# EAGLE schematic gameboyzero-tft (EAGLE 8.3.2)
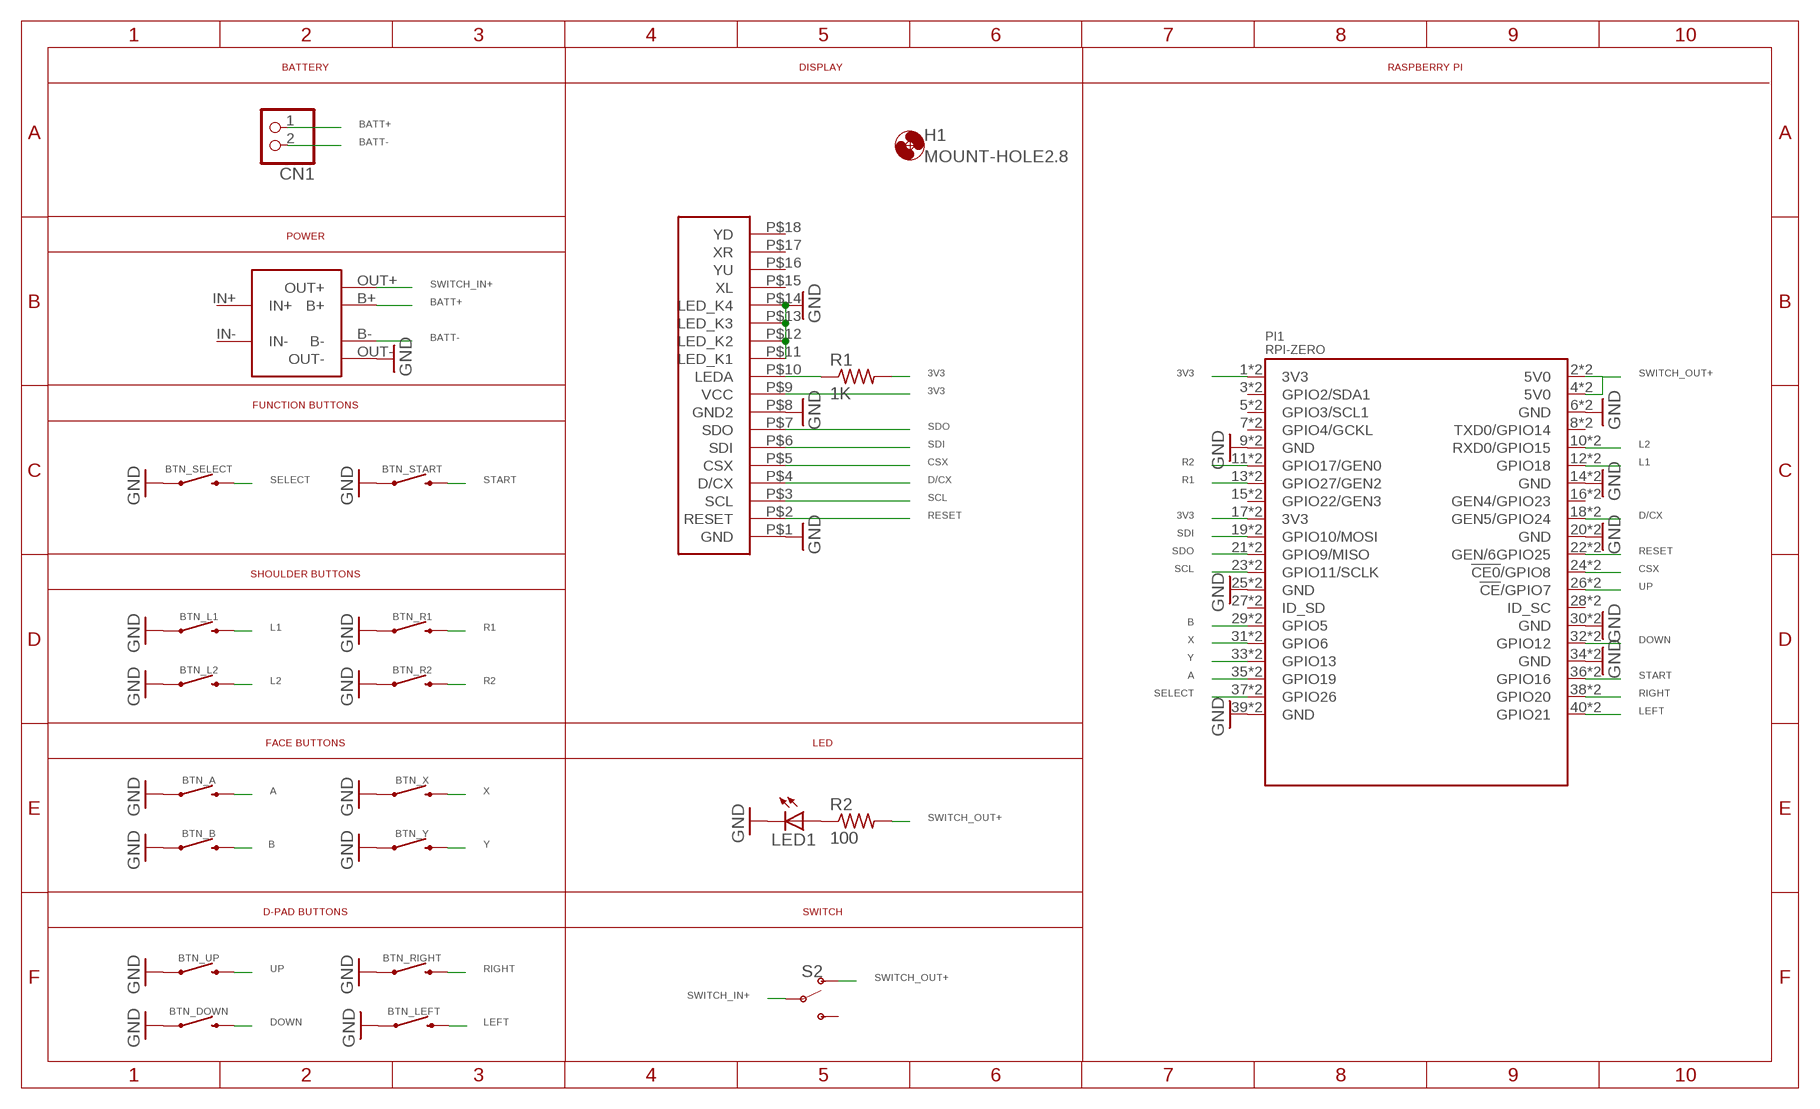
[diagram p0: schematic, sheet 1]

## Parts
BTN_A  MOMENTARY-SWITCH-SPST-SMD-12MM  [TACTILE_SWITCH_SMD_12MM]
BTN_B  MOMENTARY-SWITCH-SPST-SMD-12MM  [TACTILE_SWITCH_SMD_12MM]
BTN_DOWN  MOMENTARY-SWITCH-SPST-SMD-6.2MM-TALL  [TACTILE_SWITCH_SMD_6.2MM_TALL]
BTN_L1  MOMENTARY-SWITCH-SPST-SMD-12MM  [TACTILE_SWITCH_SMD_12MM]
BTN_L2  MOMENTARY-SWITCH-SPST-SMD-12MM  [TACTILE_SWITCH_SMD_12MM]
BTN_LEFT  MOMENTARY-SWITCH-SPST-SMD-6.2MM-TALL  [TACTILE_SWITCH_SMD_6.2MM_TALL]
BTN_R1  MOMENTARY-SWITCH-SPST-SMD-12MM  [TACTILE_SWITCH_SMD_12MM]
BTN_R2  MOMENTARY-SWITCH-SPST-SMD-12MM  [TACTILE_SWITCH_SMD_12MM]
BTN_RIGHT  MOMENTARY-SWITCH-SPST-SMD-6.2MM-TALL  [TACTILE_SWITCH_SMD_6.2MM_TALL]
BTN_SELECT  MOMENTARY-SWITCH-SPST-SMD-6.0X3.5MM  [TACTILE_SWITCH_SMD_6.0X3.5MM]
BTN_START  MOMENTARY-SWITCH-SPST-SMD-6.0X3.5MM  [TACTILE_SWITCH_SMD_6.0X3.5MM]
BTN_UP  MOMENTARY-SWITCH-SPST-SMD-6.2MM-TALL  [TACTILE_SWITCH_SMD_6.2MM_TALL]
BTN_X  MOMENTARY-SWITCH-SPST-SMD-12MM  [TACTILE_SWITCH_SMD_12MM]
BTN_Y  MOMENTARY-SWITCH-SPST-SMD-12MM  [TACTILE_SWITCH_SMD_12MM]
CN1  JST_2PIN-SMT  [JST-PH-2-SMT]
H1  MOUNT-HOLE2.8  [2,8]
LED1  LEDCHIPLED_0805  [CHIPLED_0805]
PI1  RPI-ZERO  [RASPBERRYPI_BASTELSTUBE_V13_RASPI_BOARD_B+_FULL]
POWER1  03962A  [03962A]
R1  1K  R-US_R0805  [R0805]
R2  100  R-US_R0805  [R0805]
S2  SWITCH-SPDT-SMD-RIGHT-ANGLE  [SWITCH_SPST_SMD_A]
SCREEN1  GAMEBOYZEROHANDHELDDISPLAYS-2.8  [GAMEBOYZEROHANDHELDDISPLAYS-2.8]

## Nets
3V3: PI1.1(3V3) PI1.17(3V3) PI1.41(3V3) PI1.57(3V3) R1.2 SCREEN1.P$9(VCC)
3V3100OHM: R1.1 SCREEN1.P$10(LEDA)
A: BTN_A.3 PI1.35(GPIO19) PI1.75(GPIO19)
B: BTN_B.3 PI1.29(GPIO5) PI1.69(GPIO5)
BATT+: CN1.1 POWER1.B+
BATT-: CN1.2 POWER1.B-
CSX: PI1.24(!CE0!/GPIO8) PI1.64(!CE0!/GPIO8) SCREEN1.P$5(CSX)
D/CX: PI1.18(GEN5/GPIO24) PI1.58(GEN5/GPIO24) SCREEN1.P$4(D/CX)
DOWN: BTN_DOWN.B2 PI1.32(GPIO12) PI1.72(GPIO12)
GND: BTN_A.1 BTN_B.1 BTN_DOWN.A2 BTN_L1.1 BTN_L2.1 BTN_LEFT.A2 BTN_R1.1 BTN_R2.1 BTN_RIGHT.A2 BTN_SELECT.1 BTN_START.1 BTN_UP.A2 BTN_X.1 BTN_Y.1 LED1.C PI1.6(GND) PI1.9(GND) PI1.14(GND) PI1.20(GND) PI1.25(GND) PI1.30(GND) PI1.34(GND) PI1.39(GND) PI1.46(GND) PI1.49(GND) PI1.54(GND) PI1.60(GND) PI1.65(GND) PI1.70(GND) PI1.74(GND) PI1.79(GND) POWER1.OUT- SCREEN1.P$1(GND) SCREEN1.P$8(GND2) SCREEN1.P$11(LED_K1) SCREEN1.P$12(LED_K2) SCREEN1.P$13(LED_K3) SCREEN1.P$14(LED_K4)
L1: BTN_L1.3 PI1.12(GPIO18) PI1.52(GPIO18)
L2: BTN_L2.3 PI1.10(RXD0/GPIO15) PI1.50(RXD0/GPIO15)
LED: LED1.A R2.1
LEFT: BTN_LEFT.B2 PI1.40(GPIO21) PI1.80(GPIO21)
R1: BTN_R1.3 PI1.13(GPIO27/GEN2) PI1.53(GPIO27/GEN2)
R2: BTN_R2.3 PI1.11(GPIO17/GEN0) PI1.51(GPIO17/GEN0)
RESET: PI1.22(GEN/6GPIO25) PI1.62(GEN/6GPIO25) SCREEN1.P$2(RESET)
RIGHT: BTN_RIGHT.B2 PI1.38(GPIO20) PI1.78(GPIO20)
SCL: PI1.23(GPIO11/SCLK) PI1.63(GPIO11/SCLK) SCREEN1.P$3(SCL)
SDI: PI1.19(GPIO10/MOSI) PI1.59(GPIO10/MOSI) SCREEN1.P$6(SDI)
SDO: PI1.21(GPIO9/MISO) PI1.61(GPIO9/MISO) SCREEN1.P$7(SDO)
SELECT: BTN_SELECT.2 PI1.37(GPIO26) PI1.77(GPIO26)
START: BTN_START.2 PI1.36(GPIO16) PI1.76(GPIO16)
SWITCH_IN+: POWER1.OUT+ S2.2(P)
SWITCH_OUT+: PI1.2(5V0) PI1.4(5V0) PI1.42(5V0) PI1.44(5V0) R2.2 S2.1(O)
UP: BTN_UP.B2 PI1.26(!CE!/GPIO7) PI1.66(!CE!/GPIO7)
X: BTN_X.3 PI1.31(GPIO6) PI1.71(GPIO6)
Y: BTN_Y.3 PI1.33(GPIO13) PI1.73(GPIO13)
Unconnected: PI1.3(GPIO2/SDA1) PI1.5(GPIO3/SCL1) PI1.7(GPIO4/GCKL) PI1.8(TXD0/GPIO14) PI1.15(GPIO22/GEN3) PI1.16(GEN4/GPIO23) PI1.27(ID_SD) PI1.28(ID_SC) PI1.43(GPIO2/SDA1) PI1.45(GPIO3/SCL1) PI1.47(GPIO4/GCKL) PI1.48(TXD0/GPIO14) PI1.55(GPIO22/GEN3) PI1.56(GEN4/GPIO23) PI1.67(ID_SD) PI1.68(ID_SC) POWER1.IN+ POWER1.IN- S2.3(S) SCREEN1.P$15(XL) SCREEN1.P$16(YU) SCREEN1.P$17(XR) SCREEN1.P$18(YD)

## Notes on the sheet
- BATTERY | DISPLAY | RASPBERRY PI
- POWER
- FUNCTION BUTTONS
- SHOULDER BUTTONS
- FACE BUTTONS | LED
- D-PAD BUTTONS | SWITCH

## Library data of the parts
BTN_A BTN_B BTN_L1 BTN_L2 BTN_R1 BTN_R2 BTN_X BTN_Y = SparkFun-Switches:MOMENTARY-SWITCH-SPST: Momentary Switch (Pushbutton) - SPST Normally-open (NO) SPST momentary switches (buttons, pushbuttons). Variants PTH-12MM - 12mm square, through-hole Momentary Pushbutton Switch - 12mm Square <https://www.sparkfun.com/products/9190> (COM-09190) PTH-6.0MM, PTH-6.0MM-KIT - 6.0mm square, through-hole Mini Pushbutton Switch <https://www.sparkfun.com/products/97> (COM-00097) KIT package intended for soldering kit's - only one side of pads' copper is exposed. PTH-RIGHT-ANGLE-KIT - Right-angle, through-hole Right Angle Tactile Button <https://www.sparkfun.com/products/10791> - Used on SparkFun BigTime Watch Kit <https://www.sparkfun.com/products/11734> SMD-12MM - 12mm square, surface-mount Tactile Button - SMD (12mm) <https://www.sparkfun.com/products/12993> (COM-12993) Used on SparkFun PicoBoard <https://www.sparkfun.com/products/11888> SMD-4.5MM - 4.5mm Square Trackball Switch Used on SparkFun Blackberry Trackballer Breakout <https://www.sparkfun.com/products/13169> SMD-4.6MMX2.8MM - 4.60mm x 2.80mm, surface mount Used on SparkFun SAMD21 Mini Breakout <https://www.sparkfun.com/products/13664> SMD-5.2MM, SMD-5.2-REDUNDANT - 5.2mm square, surface-mount Mini Pushbutton Switch - SMD <https://www.sparkfun.com/products/8720> (COM-08720) Used on Arduino Pro Mini <https://www.sparkfun.com/products/11114> REDUNDANT package connects both switch circuits together SMD-6.0X3.5MM - 6.0 x 3.5mm, surface mount Momentary Reset Switch SMD <https://www.sparkfun.com/products/8229> (COM-08229) SMD-6.2MM-TALL - 6.2mm square, surface mount Tactile Button - SMD (6mm) <https://www.sparkfun.com/products/12992> Used on SparkFun Digital Sandbox <https://www.sparkfun.com/products/12651> SMD-RIGHT-ANGLE - Right-angle, surface mount Used on SparkFun Block for Intel® Edison - Arduino <https://www.sparkfun.com/products/13036>; PROD_ID: SWCH-11967; SF_SKU: COM-12993
BTN_DOWN BTN_LEFT BTN_RIGHT BTN_UP = SparkFun-Switches:MOMENTARY-SWITCH-SPST: Momentary Switch (Pushbutton) - SPST Normally-open (NO) SPST momentary switches (buttons, pushbuttons). Variants PTH-12MM - 12mm square, through-hole Momentary Pushbutton Switch - 12mm Square <https://www.sparkfun.com/products/9190> (COM-09190) PTH-6.0MM, PTH-6.0MM-KIT - 6.0mm square, through-hole Mini Pushbutton Switch <https://www.sparkfun.com/products/97> (COM-00097) KIT package intended for soldering kit's - only one side of pads' copper is exposed. PTH-RIGHT-ANGLE-KIT - Right-angle, through-hole Right Angle Tactile Button <https://www.sparkfun.com/products/10791> - Used on SparkFun BigTime Watch Kit <https://www.sparkfun.com/products/11734> SMD-12MM - 12mm square, surface-mount Tactile Button - SMD (12mm) <https://www.sparkfun.com/products/12993> (COM-12993) Used on SparkFun PicoBoard <https://www.sparkfun.com/products/11888> SMD-4.5MM - 4.5mm Square Trackball Switch Used on SparkFun Blackberry Trackballer Breakout <https://www.sparkfun.com/products/13169> SMD-4.6MMX2.8MM - 4.60mm x 2.80mm, surface mount Used on SparkFun SAMD21 Mini Breakout <https://www.sparkfun.com/products/13664> SMD-5.2MM, SMD-5.2-REDUNDANT - 5.2mm square, surface-mount Mini Pushbutton Switch - SMD <https://www.sparkfun.com/products/8720> (COM-08720) Used on Arduino Pro Mini <https://www.sparkfun.com/products/11114> REDUNDANT package connects both switch circuits together SMD-6.0X3.5MM - 6.0 x 3.5mm, surface mount Momentary Reset Switch SMD <https://www.sparkfun.com/products/8229> (COM-08229) SMD-6.2MM-TALL - 6.2mm square, surface mount Tactile Button - SMD (6mm) <https://www.sparkfun.com/products/12992> Used on SparkFun Digital Sandbox <https://www.sparkfun.com/products/12651> SMD-RIGHT-ANGLE - Right-angle, surface mount Used on SparkFun Block for Intel® Edison - Arduino <https://www.sparkfun.com/products/13036>; PROD_ID: SWCH-11966; SF_SKU: COM-12992
BTN_SELECT BTN_START = SparkFun-Switches:MOMENTARY-SWITCH-SPST: Momentary Switch (Pushbutton) - SPST Normally-open (NO) SPST momentary switches (buttons, pushbuttons). Variants PTH-12MM - 12mm square, through-hole Momentary Pushbutton Switch - 12mm Square <https://www.sparkfun.com/products/9190> (COM-09190) PTH-6.0MM, PTH-6.0MM-KIT - 6.0mm square, through-hole Mini Pushbutton Switch <https://www.sparkfun.com/products/97> (COM-00097) KIT package intended for soldering kit's - only one side of pads' copper is exposed. PTH-RIGHT-ANGLE-KIT - Right-angle, through-hole Right Angle Tactile Button <https://www.sparkfun.com/products/10791> - Used on SparkFun BigTime Watch Kit <https://www.sparkfun.com/products/11734> SMD-12MM - 12mm square, surface-mount Tactile Button - SMD (12mm) <https://www.sparkfun.com/products/12993> (COM-12993) Used on SparkFun PicoBoard <https://www.sparkfun.com/products/11888> SMD-4.5MM - 4.5mm Square Trackball Switch Used on SparkFun Blackberry Trackballer Breakout <https://www.sparkfun.com/products/13169> SMD-4.6MMX2.8MM - 4.60mm x 2.80mm, surface mount Used on SparkFun SAMD21 Mini Breakout <https://www.sparkfun.com/products/13664> SMD-5.2MM, SMD-5.2-REDUNDANT - 5.2mm square, surface-mount Mini Pushbutton Switch - SMD <https://www.sparkfun.com/products/8720> (COM-08720) Used on Arduino Pro Mini <https://www.sparkfun.com/products/11114> REDUNDANT package connects both switch circuits together SMD-6.0X3.5MM - 6.0 x 3.5mm, surface mount Momentary Reset Switch SMD <https://www.sparkfun.com/products/8229> (COM-08229) SMD-6.2MM-TALL - 6.2mm square, surface mount Tactile Button - SMD (6mm) <https://www.sparkfun.com/products/12992> Used on SparkFun Digital Sandbox <https://www.sparkfun.com/products/12651> SMD-RIGHT-ANGLE - Right-angle, surface mount Used on SparkFun Block for Intel® Edison - Arduino <https://www.sparkfun.com/products/13036>; PROD_ID: SWCH-00815; SF_SKU: COM-08229
CN1 = adafruit:JST_2PIN: JST 2-Pin Connectors of various flavors SMT-RA (S2B-PH-SM4) 4UConnector #17311 SMT (B2B-PH-SM4) THM-RA (S2B-PH) THM (B2B-PH)
H1 = holes:MOUNT-HOLE: MOUNTING HOLE with drill center marker
LED1 = adafruit:LED: LED OSRAM: - CHIPLED LG R971, LG N971, LY N971, LG Q971, LY Q971, LO R971, LY R971 LH N974, LH R974 LS Q976, LO Q976, LY Q976 LO Q996 - Hyper CHIPLED LW Q18S LB Q993, LB Q99A, LB R99A - SideLED LS A670, LO A670, LY A670, LG A670, LP A670 LB A673, LV A673, LT A673, LW A673 LH A674 LY A675 LS A676, LA A676, LO A676, LY A676, LW A676 LS A679, LY A679, LG A679 - Hyper Micro SIDELED® LS Y876, LA Y876, LO Y876, LY Y876 LT Y87S - SmartLED LW L88C, LW L88S LB L89C, LB L89S, LG L890 LS L89K, LO L89K, LY L89K LS L896, LA L896, LO L896, LY L896 - TOPLED LS T670, LO T670, LY T670, LG T670, LP T670 LSG T670, LSP T670, LSY T670, LOP T670, LYG T670 LG T671, LOG T671, LSG T671 LB T673, LV T673, LT T673, LW T673 LH T674 LS T676, LA T676, LO T676, LY T676, LB T676, LH T676, LSB T676, LW T676 LB T67C, LV T67C, LT T67C, LS T67K, LO T67K, LY T67K, LW E67C LS E67B, LA E67B, LO E67B, LY E67B, LB E67C, LV E67C, LT E67C LW T67C LS T679, LY T679, LG T679 LS T770, LO T770, LY T770, LG T770, LP T770 LB T773, LV T773, LT T773, LW T773 LH T774 LS E675, LA E675, LY E675, LS T675 LS T776, LA T776, LO T776, LY T776, LB T776 LHGB T686 LT T68C, LB T68C - Hyper Mini TOPLED® LB M676 - Mini TOPLED Santana® LG M470 LS M47K, LO M47K, LY M47K Source: http://www.osram.convergy.de/
PI1 = RPI-Zero:RPI-ZERO
POWER1 = 03962A:03962A
R1 R2 = adafruit:R-US_: RESISTOR, American symbol
S2 = SparkFun-Switches:SWITCH-SPDT: Single Pole, Double Throw (SPDT) Switch Single-pole, double-throw (SPDT) switch. Variant Overview SMD-AYZ0202 Surface Mount DPDT Switch <https://www.sparkfun.com/products/597> (COM-00597) Used on e.g. LilyPad Arduino USB - ATmega32U4 Board <https://www.sparkfun.com/products/12049> PTH-11.6X4.0MM SPDT Mini Power Switch <https://www.sparkfun.com/products/102> (COM-00102) Used on e.g. SparkFun Simon Says - Through-Hole Soldering Kit <https://www.sparkfun.com/products/10547> (KIT-10547) PTH-11.6X4.0MM-KIT KIT version of SPDT Mini Power Switch - Simplifies soldering by removing tStop of switch pins - only one side can be soldered. PTH-11.6X4.0MM-LOCK LOCK version of SPDT Mini Power Switch - Offset pins hold switch in place for easier soldering. SMD-RIGHT-ANGLE Surface Mount Right Angle Switch <https://www.sparkfun.com/products/10860> (COM-10860) Used on e.g. SparkFun ESP8266 Thing <https://www.sparkfun.com/products/13231>; PROD_ID: SWCH-10651; SF_SKU: COM-10860
SCREEN1 = GameboyZeroHandheldDisplays:GAMEBOYZEROHANDHELDDISPLAYS-2.8